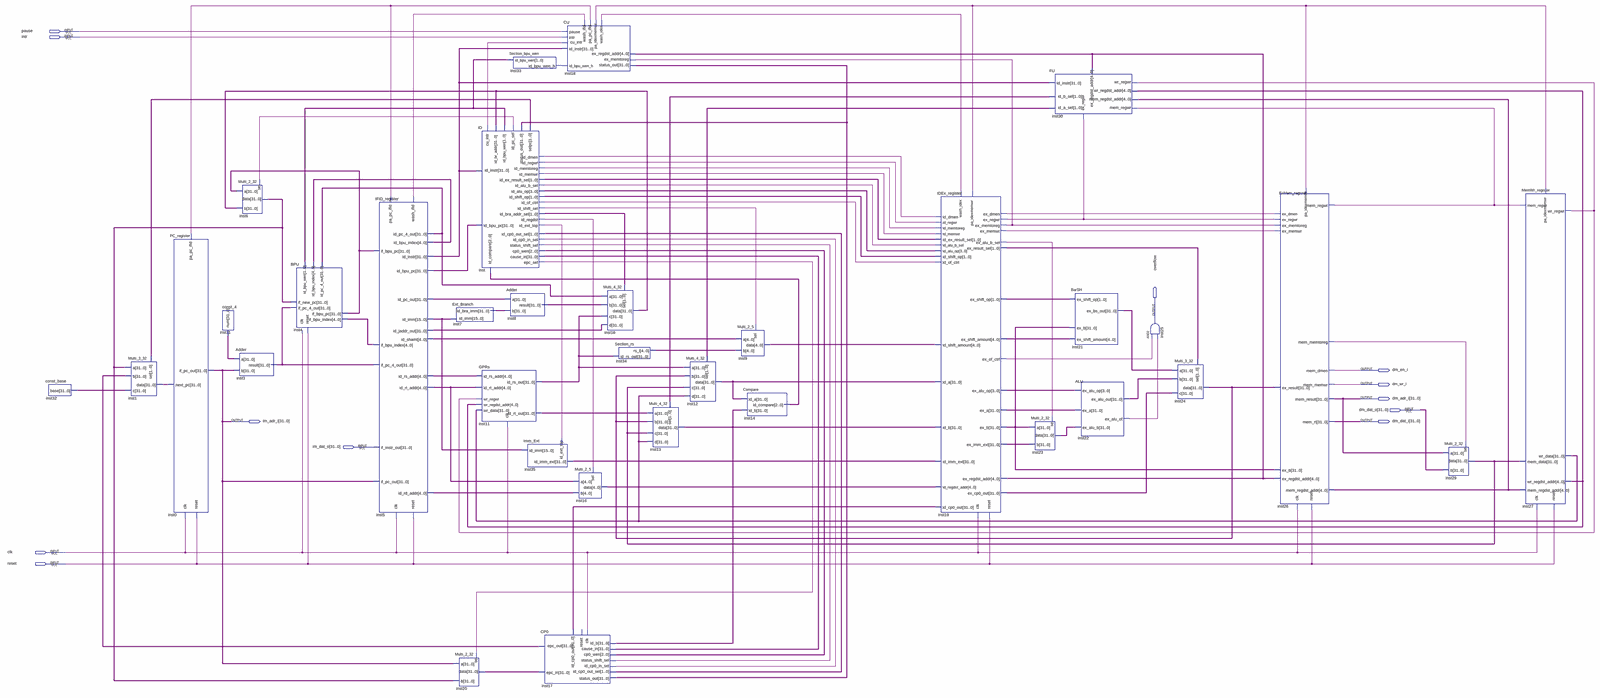
[diagram p0: schematic sheet, whole]
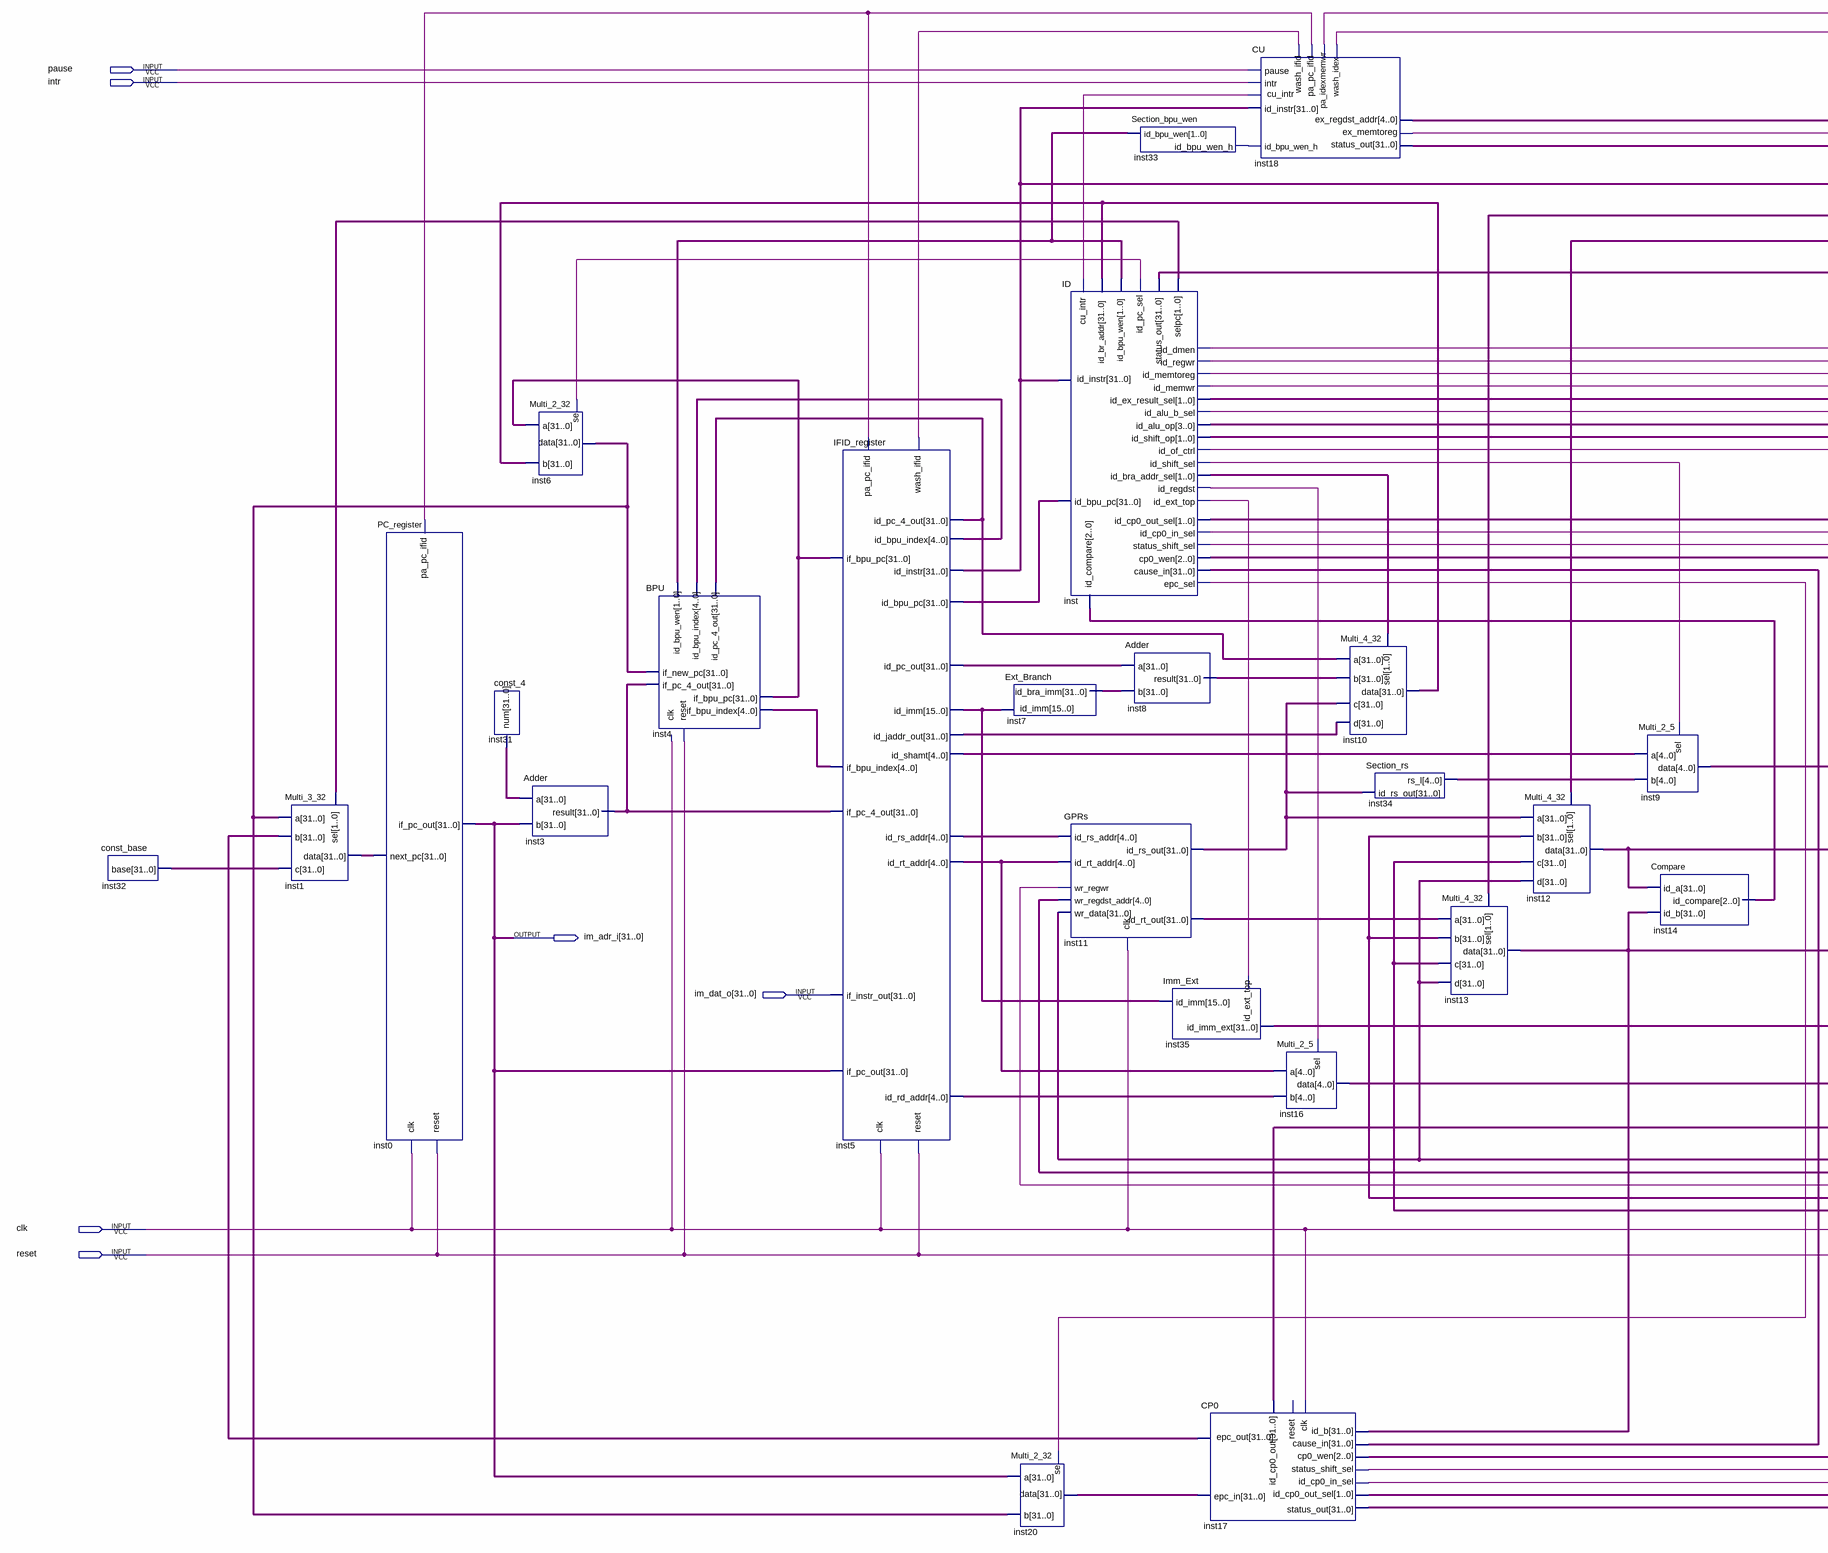
[diagram p1: schematic sheet, left part]
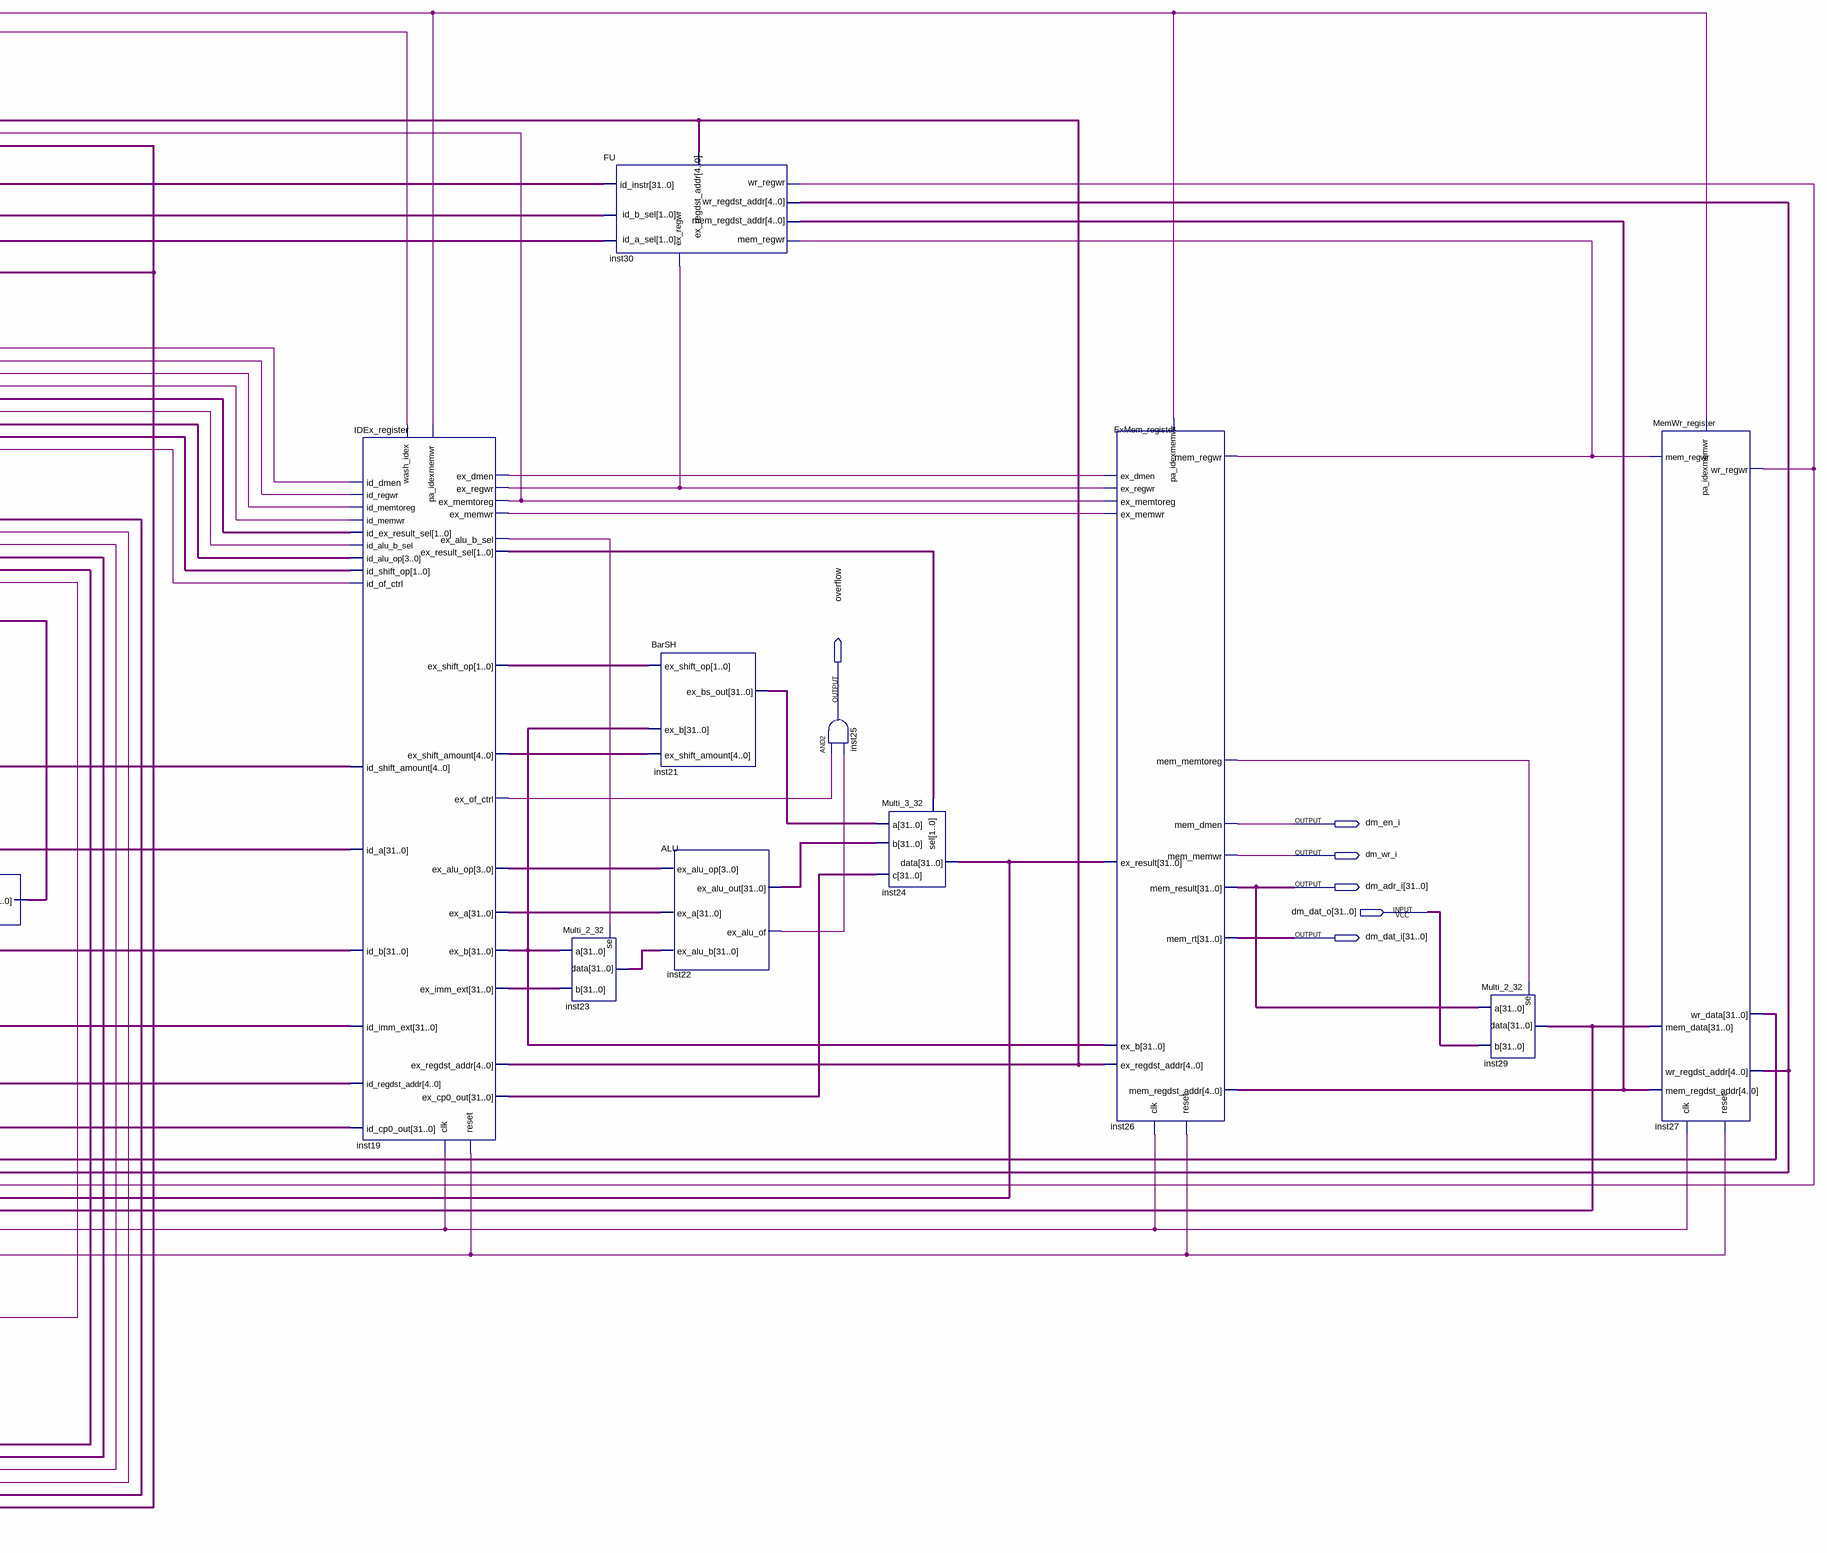
[diagram p2: schematic sheet, right part]
// Quartus schematic pipeline_cpu.bdf as structural Verilog: 34 symbols, 12 pins
module pipeline_cpu (
  input  pause,
  input  intr,
  input  [31:0] dm_dat_o,
  input  [31:0] im_dat_o,
  input  clk,
  input  reset,
  output overflow,
  output dm_en_i,
  output dm_wr_i,
  output [31:0] dm_adr_i,
  output [31:0] im_adr_i,
  output [31:0] dm_dat_i
);

  wire inst18_cu_intr, inst18_pa_idexmemwr, inst18_pa_pc_ifid, inst18_wash_idex, inst18_wash_ifid,
       inst19_ex_alu_b_sel, inst19_ex_dmen, inst19_ex_memtoreg, inst19_ex_memwr, inst19_ex_of_ctrl,
       inst19_ex_regwr, inst22_ex_alu_of, inst26_mem_memtoreg, inst26_mem_regwr, inst27_wr_regwr,
       inst33_id_bpu_wen_h, inst_epc_sel, inst_id_alu_b_sel, inst_id_cp0_in_sel, inst_id_dmen,
       inst_id_ext_top, inst_id_memtoreg, inst_id_memwr, inst_id_of_ctrl, inst_id_pc_sel, inst_id_regdst,
       inst_id_regwr, inst_id_shift_sel, inst_status_shift_sel;
  wire [1:0] inst19_ex_result_sel, inst19_ex_shift_op, inst30_id_a_sel, inst30_id_b_sel, inst_id_bpu_wen,
       inst_id_bra_addr_sel, inst_id_cp0_out_sel, inst_id_ex_result_sel, inst_id_shift_op, inst_selpc;
  wire [2:0] inst14_id_compare, inst_cp0_wen;
  wire [3:0] inst19_ex_alu_op, inst_id_alu_op;
  wire [4:0] inst4_if_bpu_index, inst5_id_bpu_index, inst5_id_rd_addr, inst5_id_rs_addr, inst5_id_rt_addr,
       inst5_id_shamt, inst9_data, inst16_data, inst19_ex_regdst_addr, inst19_ex_shift_amount,
       inst26_mem_regdst_addr, inst27_wr_regdst_addr, inst34_rs_l;
  wire [15:0] inst5_id_imm;
  wire [31:0] inst1_data, inst3_result, inst4_if_bpu_pc, inst5_id_bpu_pc, inst5_id_instr, inst5_id_jaddr_out,
       inst5_id_pc_4_out, inst5_id_pc_out, inst6_data, inst7_id_bra_imm, inst8_result, inst10_data,
       inst11_id_rs_out, inst11_id_rt_out, inst12_data, inst13_data, inst17_epc_out, inst17_id_cp0_out,
       inst17_status_out, inst19_ex_a, inst19_ex_b, inst19_ex_cp0_out, inst19_ex_imm_ext, inst20_data,
       inst21_ex_bs_out, inst22_ex_alu_out, inst23_data, inst24_data, inst27_wr_data, inst29_data,
       inst31_num, inst32_base, inst35_id_imm_ext, inst_cause_in;

  const_base inst32 (.base(inst32_base));
  Multi_3_32 inst1 (.a(inst6_data), .b(inst17_epc_out), .c(inst32_base), .sel(inst_selpc), .data(inst1_data));
  PC_register inst0 (
    .clk(clk), .reset(reset), .pa_pc_ifid(inst18_pa_pc_ifid), .next_pc(inst1_data), .if_pc_out(im_adr_i));
  const_4 inst31 (.num(inst31_num));
  Adder inst3 (.a(inst31_num), .b(im_adr_i), .result(inst3_result));
  Multi_2_32 inst6 (.a(inst4_if_bpu_pc), .b(inst10_data), .sel(inst_id_pc_sel), .data(inst6_data));
  BPU inst4 (
    .clk(clk), .reset(reset), .if_pc_4_out(inst3_result), .id_bpu_wen(inst_id_bpu_wen),
    .if_new_pc(inst6_data), .id_pc_4_out(inst5_id_pc_4_out), .id_bpu_index(inst5_id_bpu_index),
    .if_bpu_pc(inst4_if_bpu_pc), .if_bpu_index(inst4_if_bpu_index));
  IFID_register inst5 (
    .clk(clk), .reset(reset), .pa_pc_ifid(inst18_pa_pc_ifid), .wash_ifid(inst18_wash_ifid),
    .if_bpu_pc(inst4_if_bpu_pc), .if_bpu_index(inst4_if_bpu_index), .if_pc_4_out(inst3_result),
    .if_instr_out(im_dat_o), .if_pc_out(im_adr_i), .id_pc_4_out(inst5_id_pc_4_out),
    .id_jaddr_out(inst5_id_jaddr_out), .id_bpu_pc(inst5_id_bpu_pc), .id_bpu_index(inst5_id_bpu_index),
    .id_instr(inst5_id_instr), .id_imm(inst5_id_imm), .id_pc_out(inst5_id_pc_out), .id_shamt(inst5_id_shamt),
    .id_rs_addr(inst5_id_rs_addr), .id_rt_addr(inst5_id_rt_addr), .id_rd_addr(inst5_id_rd_addr));
  Ext_Branch inst7 (.id_imm(inst5_id_imm), .id_bra_imm(inst7_id_bra_imm));
  Multi_2_32 inst20 (.a(im_adr_i), .b(inst6_data), .sel(inst_epc_sel), .data(inst20_data));
  ID inst (
    .cu_intr(inst18_cu_intr), .id_bpu_pc(inst5_id_bpu_pc), .id_instr(inst5_id_instr),
    .id_br_addr(inst10_data), .status_out(inst17_status_out), .id_compare(inst14_id_compare),
    .id_pc_sel(inst_id_pc_sel), .id_bpu_wen(inst_id_bpu_wen), .selpc(inst_selpc), .id_dmen(inst_id_dmen),
    .id_regwr(inst_id_regwr), .id_memtoreg(inst_id_memtoreg), .id_memwr(inst_id_memwr),
    .id_ex_result_sel(inst_id_ex_result_sel), .id_alu_b_sel(inst_id_alu_b_sel), .id_alu_op(inst_id_alu_op),
    .id_shift_op(inst_id_shift_op), .id_bra_addr_sel(inst_id_bra_addr_sel), .id_shift_sel(inst_id_shift_sel),
    .id_ext_top(inst_id_ext_top), .id_regdst(inst_id_regdst), .id_cp0_out_sel(inst_id_cp0_out_sel),
    .id_cp0_in_sel(inst_id_cp0_in_sel), .status_shift_sel(inst_status_shift_sel), .epc_sel(inst_epc_sel),
    .id_of_ctrl(inst_id_of_ctrl), .cp0_wen(inst_cp0_wen), .cause_in(inst_cause_in));
  GPRs inst11 (
    .clk(clk), .id_rs_addr(inst5_id_rs_addr), .id_rt_addr(inst5_id_rt_addr), .wr_regwr(inst27_wr_regwr),
    .wr_regdst_addr(inst27_wr_regdst_addr), .wr_data(inst27_wr_data), .id_rs_out(inst11_id_rs_out),
    .id_rt_out(inst11_id_rt_out));
  Section_bpu_wen inst33 (.id_bpu_wen(inst_id_bpu_wen), .id_bpu_wen_h(inst33_id_bpu_wen_h));
  Adder inst8 (.a(inst5_id_pc_out), .b(inst7_id_bra_imm), .result(inst8_result));
  Imm_Ext inst35 (.id_imm(inst5_id_imm), .id_ext_top(inst_id_ext_top), .id_imm_ext(inst35_id_imm_ext));
  CP0 inst17 (
    .clk(clk), .cp0_wen(inst_cp0_wen), .id_b(inst13_data), .id_cp0_in_sel(inst_id_cp0_in_sel),
    .status_shift_sel(inst_status_shift_sel), .cause_in(inst_cause_in), .epc_in(inst20_data),
    .id_cp0_out_sel(inst_id_cp0_out_sel), .id_cp0_out(inst17_id_cp0_out), .status_out(inst17_status_out),
    .epc_out(inst17_epc_out));  // open: reset
  CU inst18 (
    .pause(pause), .intr(intr), .status_out(inst17_status_out), .id_instr(inst5_id_instr),
    .ex_memtoreg(inst19_ex_memtoreg), .id_bpu_wen_h(inst33_id_bpu_wen_h),
    .ex_regdst_addr(inst19_ex_regdst_addr), .pa_pc_ifid(inst18_pa_pc_ifid), .wash_ifid(inst18_wash_ifid),
    .pa_idexmemwr(inst18_pa_idexmemwr), .wash_idex(inst18_wash_idex), .cu_intr(inst18_cu_intr));
  Multi_2_5 inst16 (.a(inst5_id_rt_addr), .b(inst5_id_rd_addr), .sel(inst_id_regdst), .data(inst16_data));
  Multi_4_32 inst10 (
    .a(inst5_id_pc_4_out), .b(inst8_result), .c(inst11_id_rs_out), .d(inst5_id_jaddr_out),
    .sel(inst_id_bra_addr_sel), .data(inst10_data));
  Section_rs inst34 (.id_rs_out(inst11_id_rs_out), .rs_l(inst34_rs_l));
  Multi_4_32 inst13 (
    .a(inst11_id_rt_out), .b(inst24_data), .c(inst29_data), .d(inst27_wr_data), .sel(inst30_id_b_sel),
    .data(inst13_data));
  Multi_4_32 inst12 (
    .a(inst11_id_rs_out), .b(inst24_data), .c(inst29_data), .d(inst27_wr_data), .sel(inst30_id_a_sel),
    .data(inst12_data));
  Multi_2_5 inst9 (.a(inst5_id_shamt), .b(inst34_rs_l), .sel(inst_id_shift_sel), .data(inst9_data));
  Compare inst14 (.id_a(inst12_data), .id_b(inst13_data), .id_compare(inst14_id_compare));
  IDEx_register inst19 (
    .clk(clk), .reset(reset), .pa_idexmemwr(inst18_pa_idexmemwr), .wash_idex(inst18_wash_idex),
    .id_regwr(inst_id_regwr), .id_memtoreg(inst_id_memtoreg), .id_memwr(inst_id_memwr),
    .id_ex_result_sel(inst_id_ex_result_sel), .id_alu_b_sel(inst_id_alu_b_sel), .id_alu_op(inst_id_alu_op),
    .id_shift_op(inst_id_shift_op), .id_dmen(inst_id_dmen), .id_of_ctrl(inst_id_of_ctrl),
    .id_shift_amount(inst9_data), .id_a(inst12_data), .id_b(inst13_data), .id_imm_ext(inst35_id_imm_ext),
    .id_regdst_addr(inst16_data), .id_cp0_out(inst17_id_cp0_out), .ex_regwr(inst19_ex_regwr),
    .ex_memtoreg(inst19_ex_memtoreg), .ex_memwr(inst19_ex_memwr), .ex_dmen(inst19_ex_dmen),
    .ex_shift_op(inst19_ex_shift_op), .ex_shift_amount(inst19_ex_shift_amount),
    .ex_of_ctrl(inst19_ex_of_ctrl), .ex_alu_op(inst19_ex_alu_op), .ex_result_sel(inst19_ex_result_sel),
    .ex_a(inst19_ex_a), .ex_alu_b_sel(inst19_ex_alu_b_sel), .ex_b(inst19_ex_b),
    .ex_imm_ext(inst19_ex_imm_ext), .ex_regdst_addr(inst19_ex_regdst_addr), .ex_cp0_out(inst19_ex_cp0_out));
  Multi_2_32 inst23 (.a(inst19_ex_b), .b(inst19_ex_imm_ext), .sel(inst19_ex_alu_b_sel), .data(inst23_data));
  FU inst30 (
    .id_instr(inst5_id_instr), .ex_regwr(inst19_ex_regwr), .ex_regdst_addr(inst19_ex_regdst_addr),
    .mem_regwr(inst26_mem_regwr), .mem_regdst_addr(inst26_mem_regdst_addr), .wr_regwr(inst27_wr_regwr),
    .wr_regdst_addr(inst27_wr_regdst_addr), .id_a_sel(inst30_id_a_sel), .id_b_sel(inst30_id_b_sel));
  BarSH inst21 (
    .ex_shift_op(inst19_ex_shift_op), .ex_b(inst19_ex_b), .ex_shift_amount(inst19_ex_shift_amount),
    .ex_bs_out(inst21_ex_bs_out));
  ALU inst22 (
    .ex_alu_op(inst19_ex_alu_op), .ex_a(inst19_ex_a), .ex_alu_b(inst23_data), .ex_alu_out(inst22_ex_alu_out),
    .ex_alu_of(inst22_ex_alu_of));
  and inst25 (overflow, inst19_ex_of_ctrl, inst22_ex_alu_of);
  Multi_3_32 inst24 (
    .a(inst21_ex_bs_out), .b(inst22_ex_alu_out), .c(inst19_ex_cp0_out), .sel(inst19_ex_result_sel),
    .data(inst24_data));
  ExMem_register inst26 (
    .clk(clk), .reset(reset), .pa_idexmemwr(inst18_pa_idexmemwr), .ex_regwr(inst19_ex_regwr),
    .ex_memtoreg(inst19_ex_memtoreg), .ex_memwr(inst19_ex_memwr), .ex_dmen(inst19_ex_dmen),
    .ex_result(inst24_data), .ex_b(inst19_ex_b), .ex_regdst_addr(inst19_ex_regdst_addr),
    .mem_regwr(inst26_mem_regwr), .mem_dmen(dm_en_i), .mem_memtoreg(inst26_mem_memtoreg),
    .mem_memwr(dm_wr_i), .mem_result(dm_adr_i), .mem_rt(dm_dat_i), .mem_regdst_addr(inst26_mem_regdst_addr));
  Multi_2_32 inst29 (.a(dm_adr_i), .b(dm_dat_o), .sel(inst26_mem_memtoreg), .data(inst29_data));
  MemWr_register inst27 (
    .clk(clk), .reset(reset), .pa_idexmemwr(inst18_pa_idexmemwr), .mem_regwr(inst26_mem_regwr),
    .mem_data(inst29_data), .mem_regdst_addr(inst26_mem_regdst_addr), .wr_regwr(inst27_wr_regwr),
    .wr_data(inst27_wr_data), .wr_regdst_addr(inst27_wr_regdst_addr));
endmodule
